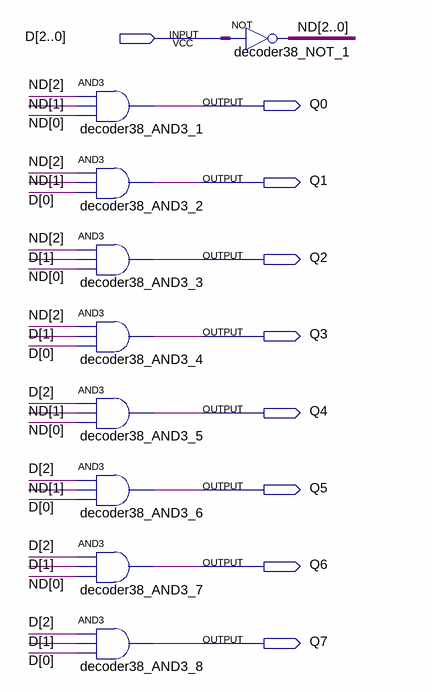
[diagram p0: schematic sheet]
// Quartus schematic decoder38.bdf as structural Verilog: 9 symbols, 9 pins
module decoder38 (
  input  [2:0] D,
  output Q0,
  output Q1,
  output Q2,
  output Q3,
  output Q4,
  output Q5,
  output Q6,
  output Q7
);

  wire [2:0] ND;

  and decoder38_AND3_1 (Q0, ND[2], ND[1], ND[0]);
  and decoder38_AND3_2 (Q1, ND[2], ND[1], D[0]);
  and decoder38_AND3_3 (Q2, ND[2], D[1], ND[0]);
  and decoder38_AND3_4 (Q3, ND[2], D[1], D[0]);
  and decoder38_AND3_5 (Q4, D[2], ND[1], ND[0]);
  and decoder38_AND3_6 (Q5, D[2], ND[1], D[0]);
  and decoder38_AND3_7 (Q6, D[2], D[1], ND[0]);
  and decoder38_AND3_8 (Q7, D[2], D[1], D[0]);
  assign ND = ~D;  // NOT decoder38_NOT_1, 3 bits wide
endmodule
